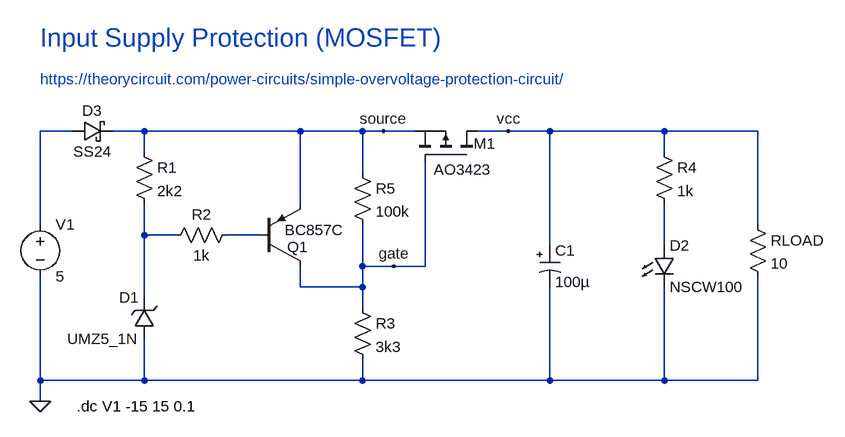
[diagram p0: schematic 02-input_voltage_5v_mosfet.asc]
02-input_voltage_5v_mosfet.asc, the LTspice schematic file:
Version 4
SHEET 1 1224 680
WIRE 64 -48 16 -48
WIRE 176 -48 128 -48
WIRE 416 -48 176 -48
WIRE 512 -48 416 -48
WIRE 544 -48 512 -48
WIRE 592 -48 544 -48
WIRE 736 -48 688 -48
WIRE 800 -48 736 -48
WIRE 976 -48 800 -48
WIRE 1120 -48 976 -48
WIRE 176 -16 176 -48
WIRE 976 -16 976 -48
WIRE 512 16 512 -48
WIRE 416 64 416 -48
WIRE 16 96 16 -48
WIRE 1120 96 1120 -48
WIRE 176 112 176 64
WIRE 224 112 176 112
WIRE 352 112 304 112
WIRE 800 128 800 -48
WIRE 976 128 976 64
WIRE 512 160 512 96
WIRE 560 160 512 160
WIRE 608 160 608 0
WIRE 608 160 560 160
WIRE 416 192 416 160
WIRE 512 192 512 160
WIRE 512 192 416 192
WIRE 176 208 176 112
WIRE 512 224 512 192
WIRE 16 336 16 176
WIRE 176 336 176 272
WIRE 176 336 16 336
WIRE 512 336 512 304
WIRE 512 336 176 336
WIRE 800 336 800 192
WIRE 800 336 512 336
WIRE 976 336 976 192
WIRE 976 336 800 336
WIRE 1120 336 1120 176
WIRE 1120 336 976 336
WIRE 16 368 16 336
FLAG 16 368 0
FLAG 736 -48 vcc
FLAG 560 160 gate
FLAG 544 -48 source
SYMBOL voltage 16 80 R0
WINDOW 123 0 0 Left 0
WINDOW 39 0 0 Left 0
SYMATTR InstName V1
SYMATTR Value 5
SYMBOL res 160 -32 R0
SYMATTR InstName R1
SYMATTR Value 2k2
SYMBOL zener 192 272 R180
WINDOW 0 24 64 Left 2
WINDOW 3 24 0 Left 2
SYMATTR InstName D1
SYMATTR Value UMZ5_1N
SYMATTR Description Diode
SYMATTR Type diode
SYMBOL res 320 96 R90
WINDOW 0 0 56 VBottom 2
WINDOW 3 32 56 VTop 2
SYMATTR InstName R2
SYMATTR Value 1k
SYMBOL pnp 352 160 M180
WINDOW 0 44 30 Left 2
WINDOW 3 40 56 Left 2
SYMATTR InstName Q1
SYMATTR Value BC857C
SYMBOL res 496 208 R0
SYMATTR InstName R3
SYMATTR Value 3k3
SYMBOL res 960 -32 R0
SYMATTR InstName R4
SYMATTR Value 1k
SYMBOL LED 960 128 R0
SYMATTR InstName D2
SYMATTR Value NSCW100
SYMATTR Description Diode
SYMATTR Type diode
SYMBOL pmos 688 0 M270
WINDOW 0 29 5 VLeft 2
WINDOW 3 -11 67 VLeft 2
SYMATTR InstName M1
SYMATTR Value AO3423
SYMBOL res 1104 80 R0
SYMATTR InstName RLOAD
SYMATTR Value 10
SYMBOL res 496 0 R0
SYMATTR InstName R5
SYMATTR Value 100k
SYMBOL schottky 64 -32 R270
WINDOW 0 32 32 VTop 2
WINDOW 3 0 32 VBottom 2
SYMATTR InstName D3
SYMATTR Value SS24
SYMATTR Description Diode
SYMATTR Type diode
SYMBOL polcap 784 128 R0
WINDOW 3 24 56 Left 2
SYMATTR InstName C1
SYMATTR Value 100µ
SYMATTR Description Capacitor
SYMATTR Type cap
SYMATTR SpiceLine V=16 Irms=265m Rser=0.35 Lser=0 mfg="Nichicon" pn="UPL1C101MPH" type="Al electrolytic"
TEXT 72 376 Left 2 !.dc V1 -15 15 0.1
TEXT 16 -128 Left 2 ;https://theorycircuit.com/power-circuits/simple-overvoltage-protection-circuit/
TEXT 16 -192 Left 4 ;Input Supply Protection (MOSFET)

The netlist it stands for:
* 02-input_voltage_5v_mosfet.asc
V1 N001 0 5
R1 source N002 2k2
D1 0 N002 UMZ5_1N
R2 N003 N002 1k
Q1 gate N003 source 0 BC857C
R3 gate 0 3k3
R4 vcc N004 1k
D2 N004 0 NSCW100
M1 vcc gate source source AO3423
RLOAD vcc 0 10
R5 source gate 100k
D3 N001 source SS24
C1 vcc 0 100µ V=16 Irms=265m Rser=0.35 Lser=0 mfg="Nichicon" pn="UPL1C101MPH" type="Al electrolytic"
.model D D
.lib standard.dio
.model NPN NPN
.model PNP PNP
.lib standard.bjt
.model NMOS NMOS
.model PMOS PMOS
.lib standard.mos
.dc V1 -15 15 0.1
* https://theorycircuit.com/power-circuits/simple-overvoltage-protection-circuit/
* Input Supply Protection (MOSFET)
.backanno
.end

* Results of the author's LTspice run, read from the files saved beside the schematic
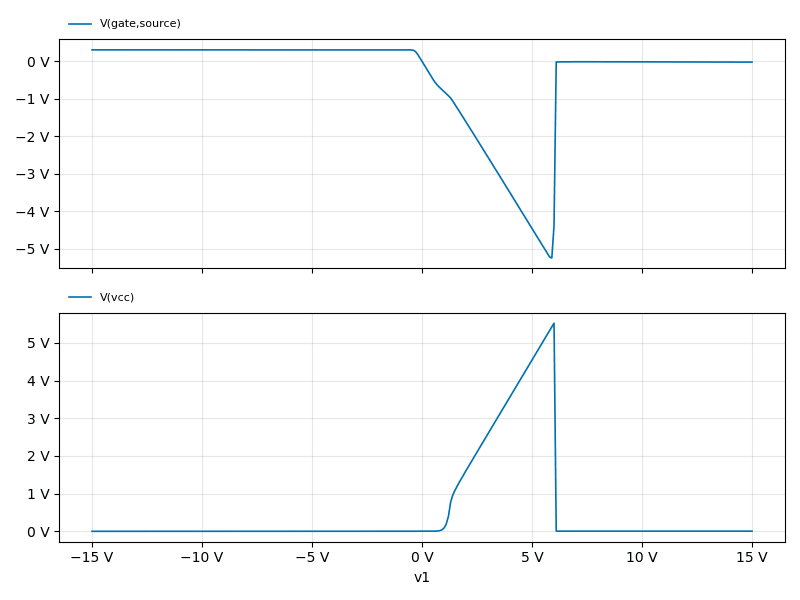
[diagram p1: DC transfer characteristic of 02-input_voltage_5v_mosfet.asc, plotted from the saved traces]
* DC transfer characteristic, 1 run:
*   V(gate,source): 306.9 mV at v1=-15 V, -20.08 mV at v1=15 V, min -5.251 V, max 306.9 mV
*   V(vcc): -3.969 mV at v1=-15 V, 5.872 µV at v1=15 V, min -3.969 mV, max 5.524 V